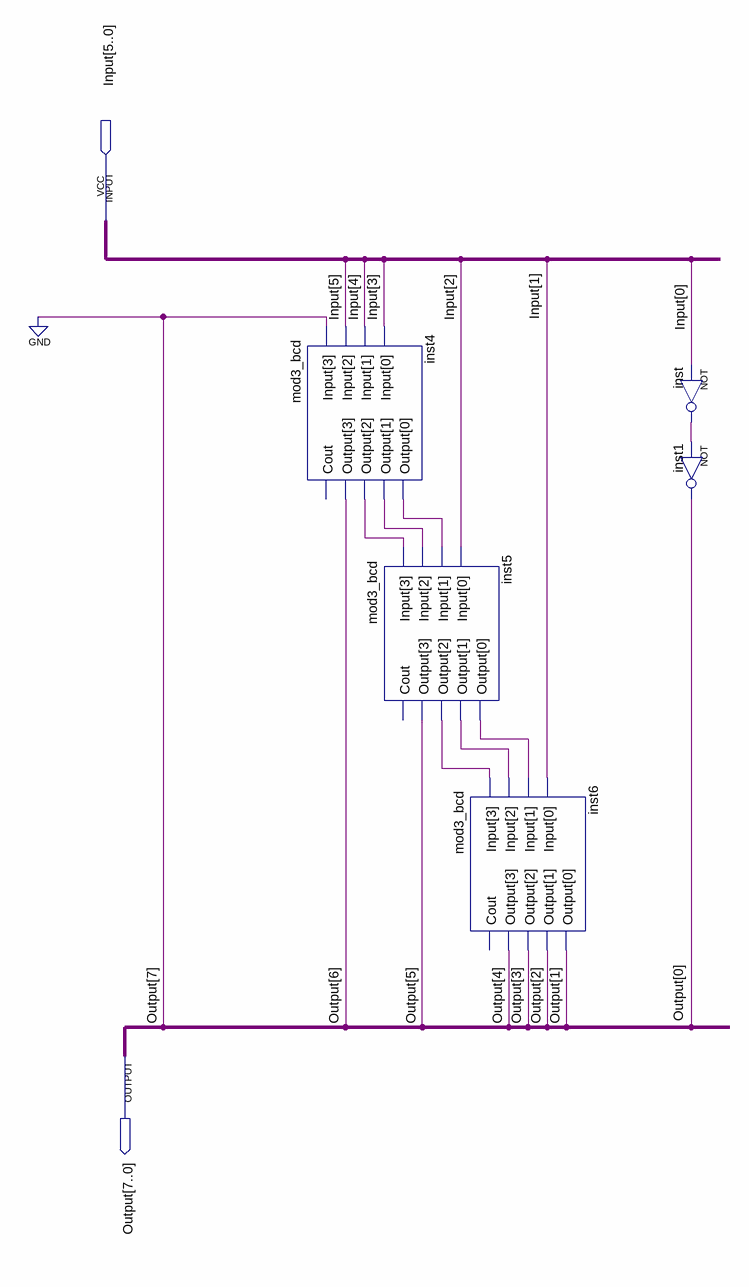
[diagram p0: schematic sheet]
// Quartus schematic sixbit_to_bcd.bdf as structural Verilog: 5 symbols, 2 pins
module sixbit_to_bcd (
  input  [5:0] Input,
  output [7:0] Output
);

  wire inst4_output, inst4_output_2, inst4_output_3, inst5_output, inst5_output_2, inst5_output_3, inst_out;

  mod3_bcd inst4 (
    .Input({1'b0, Input[5:3]}), .Output({Output[6], inst4_output, inst4_output_2, inst4_output_3}));  // open: Cout
  mod3_bcd inst5 (
    .Input({inst4_output, inst4_output_2, inst4_output_3, Input[2]}),
    .Output({Output[5], inst5_output, inst5_output_2, inst5_output_3}));  // open: Cout
  mod3_bcd inst6 (
    .Input({inst5_output, inst5_output_2, inst5_output_3, Input[1]}), .Output(Output[4:1]));  // open: Cout
  not inst (inst_out, Input[0]);
  not inst1 (Output[0], inst_out);

  assign Output[7] = 1'b0;
endmodule
